# EAGLE schematic GyroDrive (EAGLE 7.4.0)
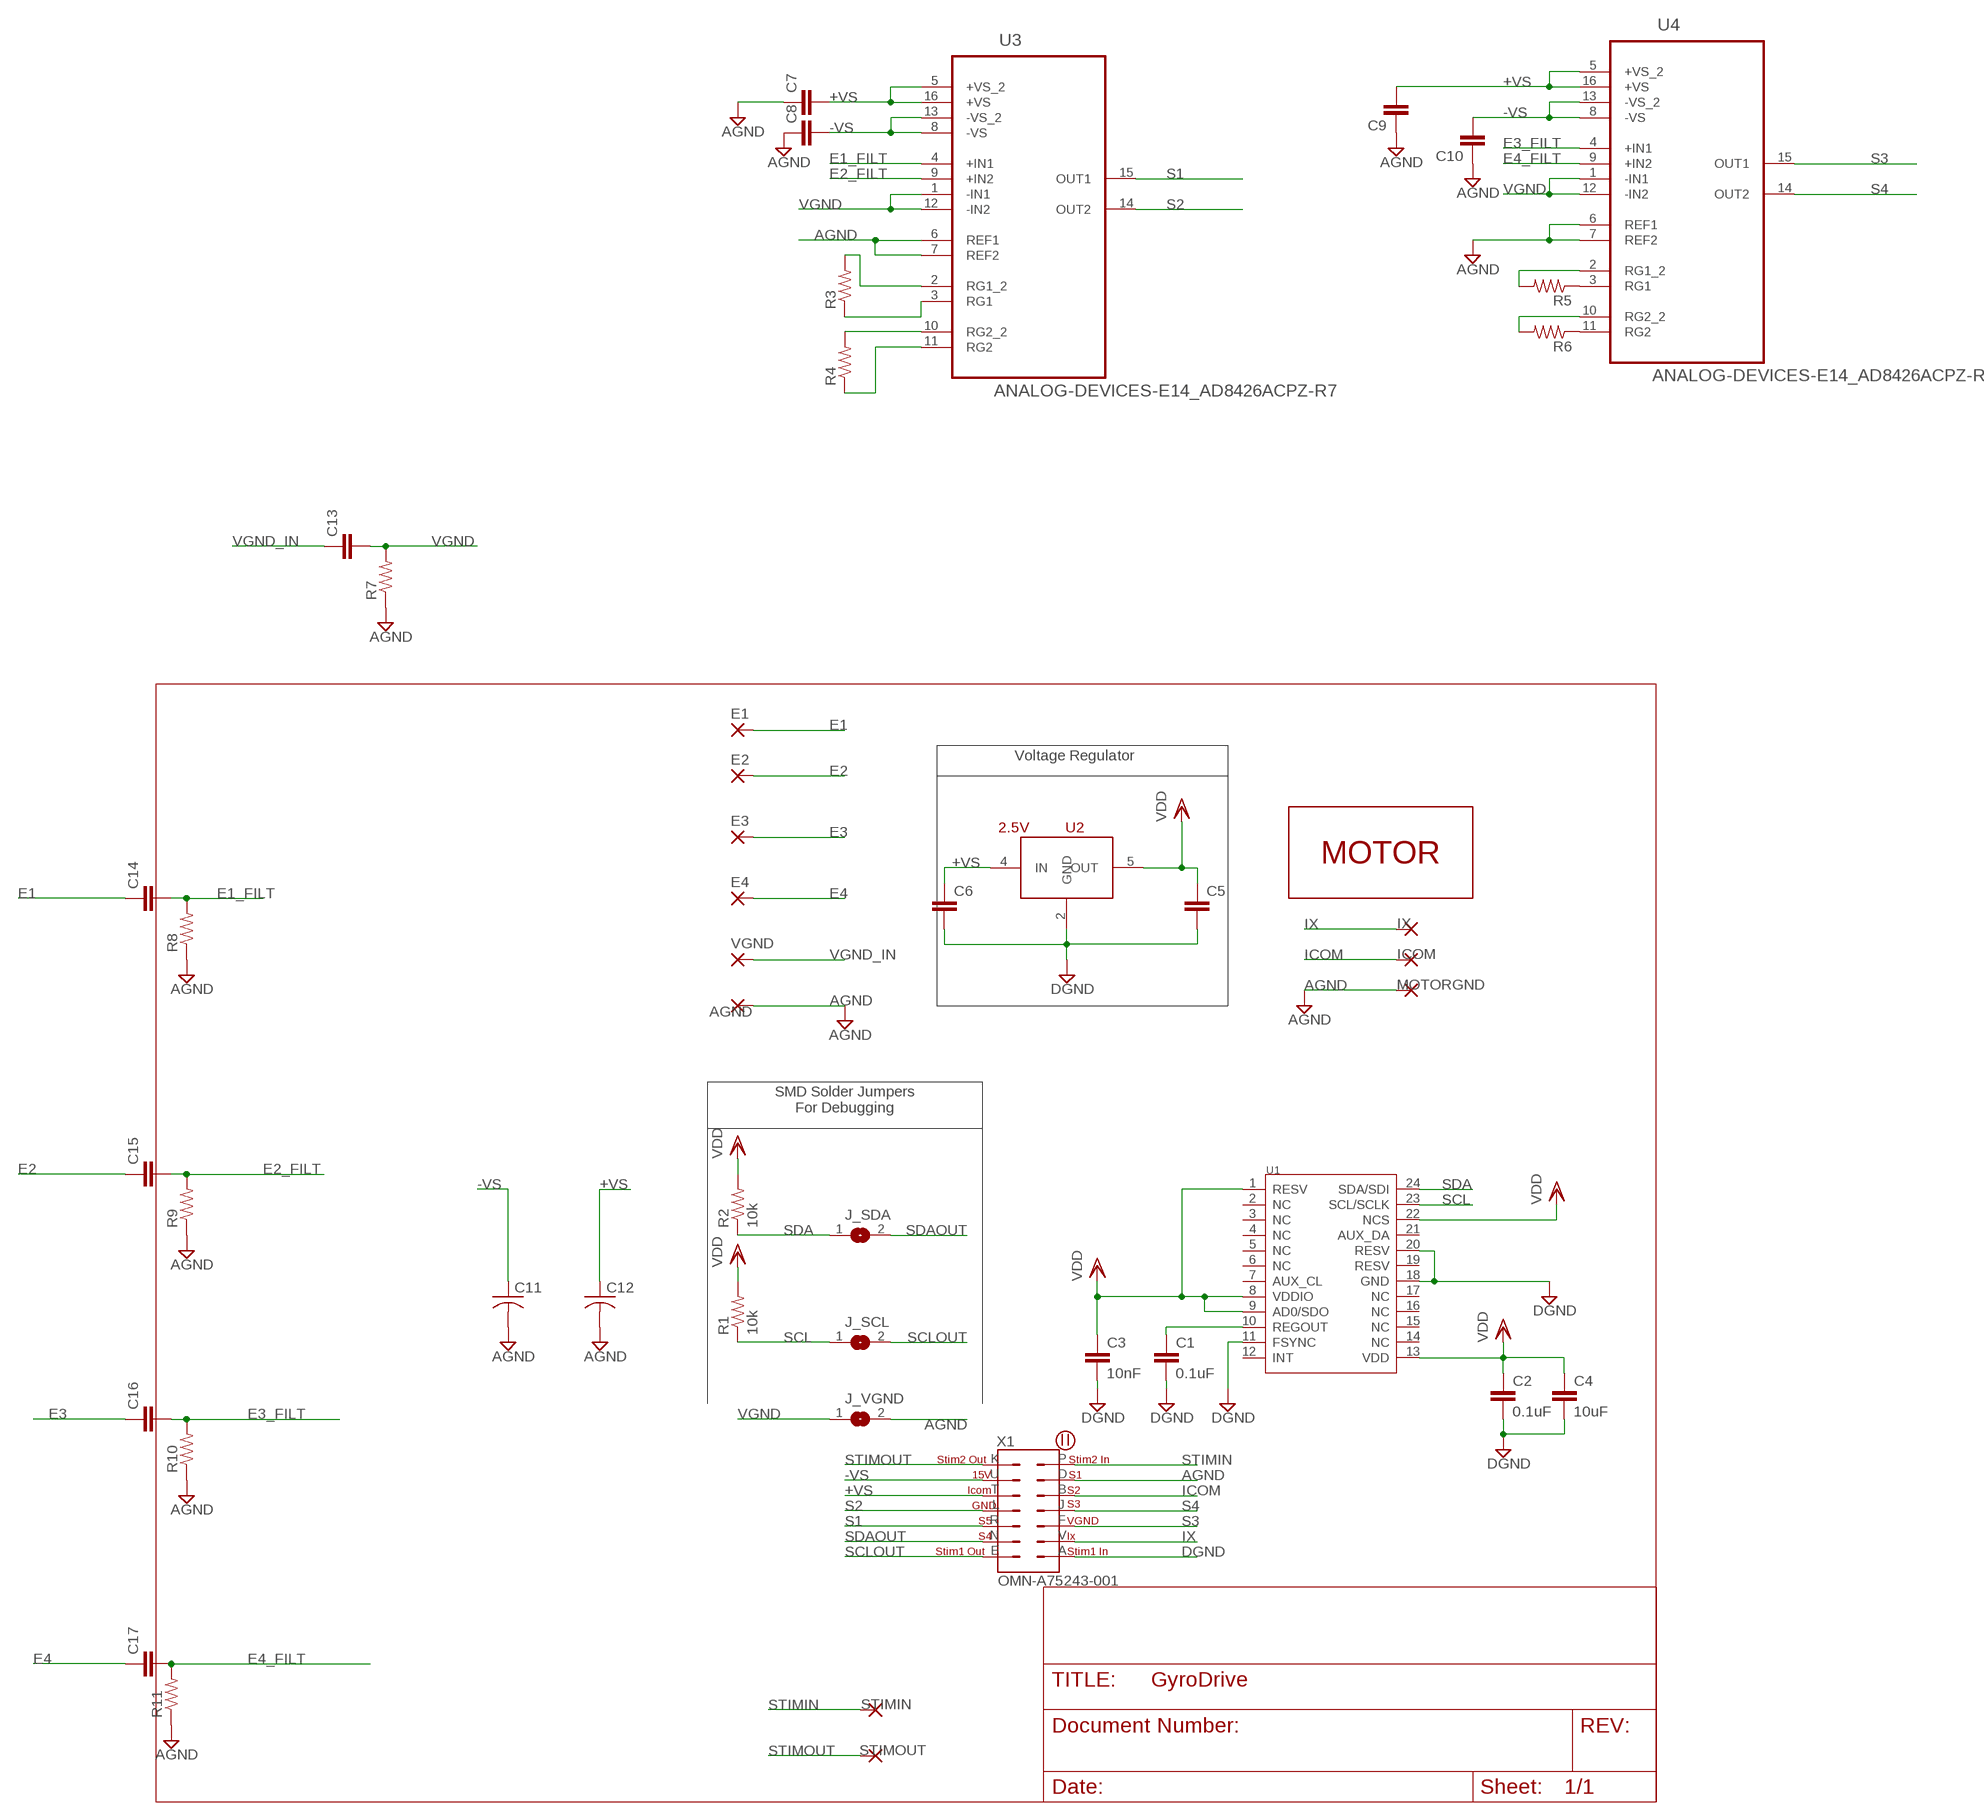
[diagram p0: schematic, sheet 1]

## Parts
AGND  THROUGH-HOLE-30MIL/15MIL  [30MIL/15MIL]
C1  0.1uF  C-EUC0402  [C0402]
C2  0.1uF  C-EUC0402  [C0402]
C3  10nF  C-EUC0402  [C0402]
C4  10uF  C-EUC0603  [C0603]
C5  C-EUC0402  [C0402]
C6  C-EUC0402  [C0402]
C7  C-EUC0201  [C0201]
C8  C-EUC0201  [C0201]
C9  C-EUC0201  [C0201]
C10  C-EUC0201  [C0201]
C11  C-USC0603  [C0603]
C12  C-USC0603  [C0603]
C13  C-EUC0201  [C0201]
C14  C-EUC0201  [C0201]
C15  C-EUC0201  [C0201]
C16  C-EUC0201  [C0201]
C17  C-EUC0201  [C0201]
E1  SMD25-25-MIL  [SMD25-25-MIL]
E2  SMD25-25-MIL  [SMD25-25-MIL]
E3  SMD25-25-MIL  [SMD25-25-MIL]
E4  SMD25-25-MIL  [SMD25-25-MIL]
ICOM  THROUGH-HOLE-30MIL/15MIL  [30MIL/15MIL]
IX  THROUGH-HOLE-30MIL/15MIL  [30MIL/15MIL]
J_SCL  SJ  [SJ]
J_SDA  SJ  [SJ]
J_VGND  SJ  [SJ]
MOTORGND  THROUGH-HOLE-30MIL/15MIL  [30MIL/15MIL]
R1  10k  R-US_R0201  [R0201]
R2  10k  R-US_R0201  [R0201]
R3  R-US_R0201  [R0201]
R4  R-US_R0201  [R0201]
R5  R-US_R0201  [R0201]
R6  R-US_R0201  [R0201]
R7  R-US_R0201  [R0201]
R8  R-US_R0201  [R0201]
R9  R-US_R0201  [R0201]
R10  R-US_R0201  [R0201]
R11  R-US_R0201  [R0201]
STIMIN  THROUGH-HOLE-30MIL/15MIL  [30MIL/15MIL]
STIMOUT  THROUGH-HOLE-30MIL/15MIL  [30MIL/15MIL]
U1  MPU-9250  [LEAD-QFN24]
U2  2.5V  TPS715-FIXED  [SC70]
U3  ANALOG-DEVICES-E14_AD8426ACPZ-R7  [ANALOG-DEVICES-E14_QFN65P400X400X100-16N]
U4  ANALOG-DEVICES-E14_AD8426ACPZ-R7  [ANALOG-DEVICES-E14_QFN65P400X400X100-16N]
U$2  MICRODRIVE-MOTOR  [0206A001B-021-47:1-Y2825]
VGND  SMD25-25-MIL  [SMD25-25-MIL]
X1  OMN-A75243-001  [OMN-A75243-001]

## Nets
+VS: C6.1 C7.2 C9.2 C12.1 U2.4(IN) U3.5(+VS_2) U3.16(+VS) U4.5(+VS_2) U4.16(+VS) X1.T
-VS: C8.2 C10.2 C11.1 U3.8(-VS) U3.13(-VS_2) U4.8(-VS) U4.13(-VS_2) X1.U
AGND: AGND.P$1(P) C7.1 C8.1 C9.1 C10.1 C11.2 C12.2 J_VGND.2 MOTORGND.P$1(P) R7.1 R8.1 R9.1 R10.1 R11.1 U3.6(REF1) U3.7(REF2) U4.6(REF1) U4.7(REF2) X1.D
DGND: C1.2 C2.2 C3.2 C4.2 C5.2 C6.2 U1.11(FSYNC) U1.18(GND) U1.20(RESV) U2.2(GND) X1.A
E1: C14.1 E1.1(P)
E1_FILT: C14.2 R8.2 U3.4(+IN1)
E2: C15.1 E2.1(P)
E2_FILT: C15.2 R9.2 U3.9(+IN2)
E3: C16.1 E3.1(P)
E3_FILT: C16.2 R10.2 U4.4(+IN1)
E4: C17.1 E4.1(P)
E4_FILT: C17.2 R11.2 U4.9(+IN2)
ICOM: ICOM.P$1(P) X1.B
IX: IX.P$1(P) X1.V
N$5: R4.2 U3.10(RG2_2)
N$7: C1.1 U1.10(REGOUT)
N$10: R4.1 U3.11(RG2)
N$11: R3.1 U3.3(RG1)
N$12: R3.2 U3.2(RG1_2)
N$14: R5.1 U4.3(RG1)
N$15: R5.2 U4.2(RG1_2)
N$16: R6.2 U4.10(RG2_2)
N$17: R6.1 U4.11(RG2)
S1: U3.15(OUT1) X1.R
S2: U3.14(OUT2) X1.L
S3: U4.15(OUT1) X1.F
S4: U4.14(OUT2) X1.J
SCL: J_SCL.1 R1.1 U1.23(SCL/SCLK)
SCLOUT: J_SCL.2 X1.E
SDA: J_SDA.1 R2.1 U1.24(SDA/SDI)
SDAOUT: J_SDA.2 X1.N
STIMIN: STIMIN.P$1(P) X1.P
STIMOUT: STIMOUT.P$1(P) X1.K
VDD: C2.1 C3.1 C4.1 C5.1 R1.2 R2.2 U1.1(RESV) U1.8(VDDIO) U1.9(AD0/SDO) U1.13(VDD) U1.22(NCS) U2.5(OUT)
VGND: C13.2 J_VGND.1 R7.2 U3.1(-IN1) U3.12(-IN2) U4.1(-IN1) U4.12(-IN2)
VGND_IN: C13.1 VGND.1(P)
Unconnected: U1.2(NC) U1.3(NC) U1.4(NC) U1.5(NC) U1.6(NC) U1.7(AUX_CL) U1.12(INT) U1.14(NC) U1.15(NC) U1.16(NC) U1.17(NC) U1.19(RESV) U1.21(AUX_DA)

## Notes on the sheet
- Voltage Regulator
- SMD Solder Jumpers
  For Debugging

## Library data of the parts
AGND ICOM IX MOTORGND STIMIN STIMOUT = michael-stetner:THROUGH-HOLE-30MIL/15MIL: THROUGH-HOLE PAD
C1-C10 C13-C17 = resistor:C-EU: CAPACITOR, European symbol
C11 C12 = resistor:C-US: CAPACITOR, American symbol
E1-E4 VGND = michael-stetner:SMD25-25-MIL: SMD PAD
J_SCL J_SDA J_VGND = michael-stetner:SJ: SMD solder JUMPER
R1-R11 = resistor:R-US_: RESISTOR, American symbol
U1 = Grove - IMU 10DOF v1.1:MPU-9250
U2 = michael-stetner:TPS715-FIXED
U3 U4 = AD8426x2 wide:ANALOG-DEVICES-E14_AD8426ACPZ-R7: Wide Supply Range, Rail-to-Rail Output Instrumentation Amplifier; MPN: AD8426ACPZ-R7; OC_FARNELL: 1971714; OC_NEWARK: 58T4523; PACKAGE: LFCSP-16; SUPPLIER: Analog Devices
U$2 = michael-stetner:MICRODRIVE-MOTOR
X1 = GFL:OMN-A75243-001